# Altium project NB3000XN.PRJPCB (part 3 of 3)

## Sheet Ethernet_RTL8201CL.SchDoc: Ethernet Interface
size A3; DocumentNumber: 21; SheetNumber: 22; SheetTotal: 78; Organization: Altium Limited.; Address1: Level 3, 12a Rodborough Rd; Address2: Frenchs Forest 2086; Address3: NSW; Address4: AUSTRALIA
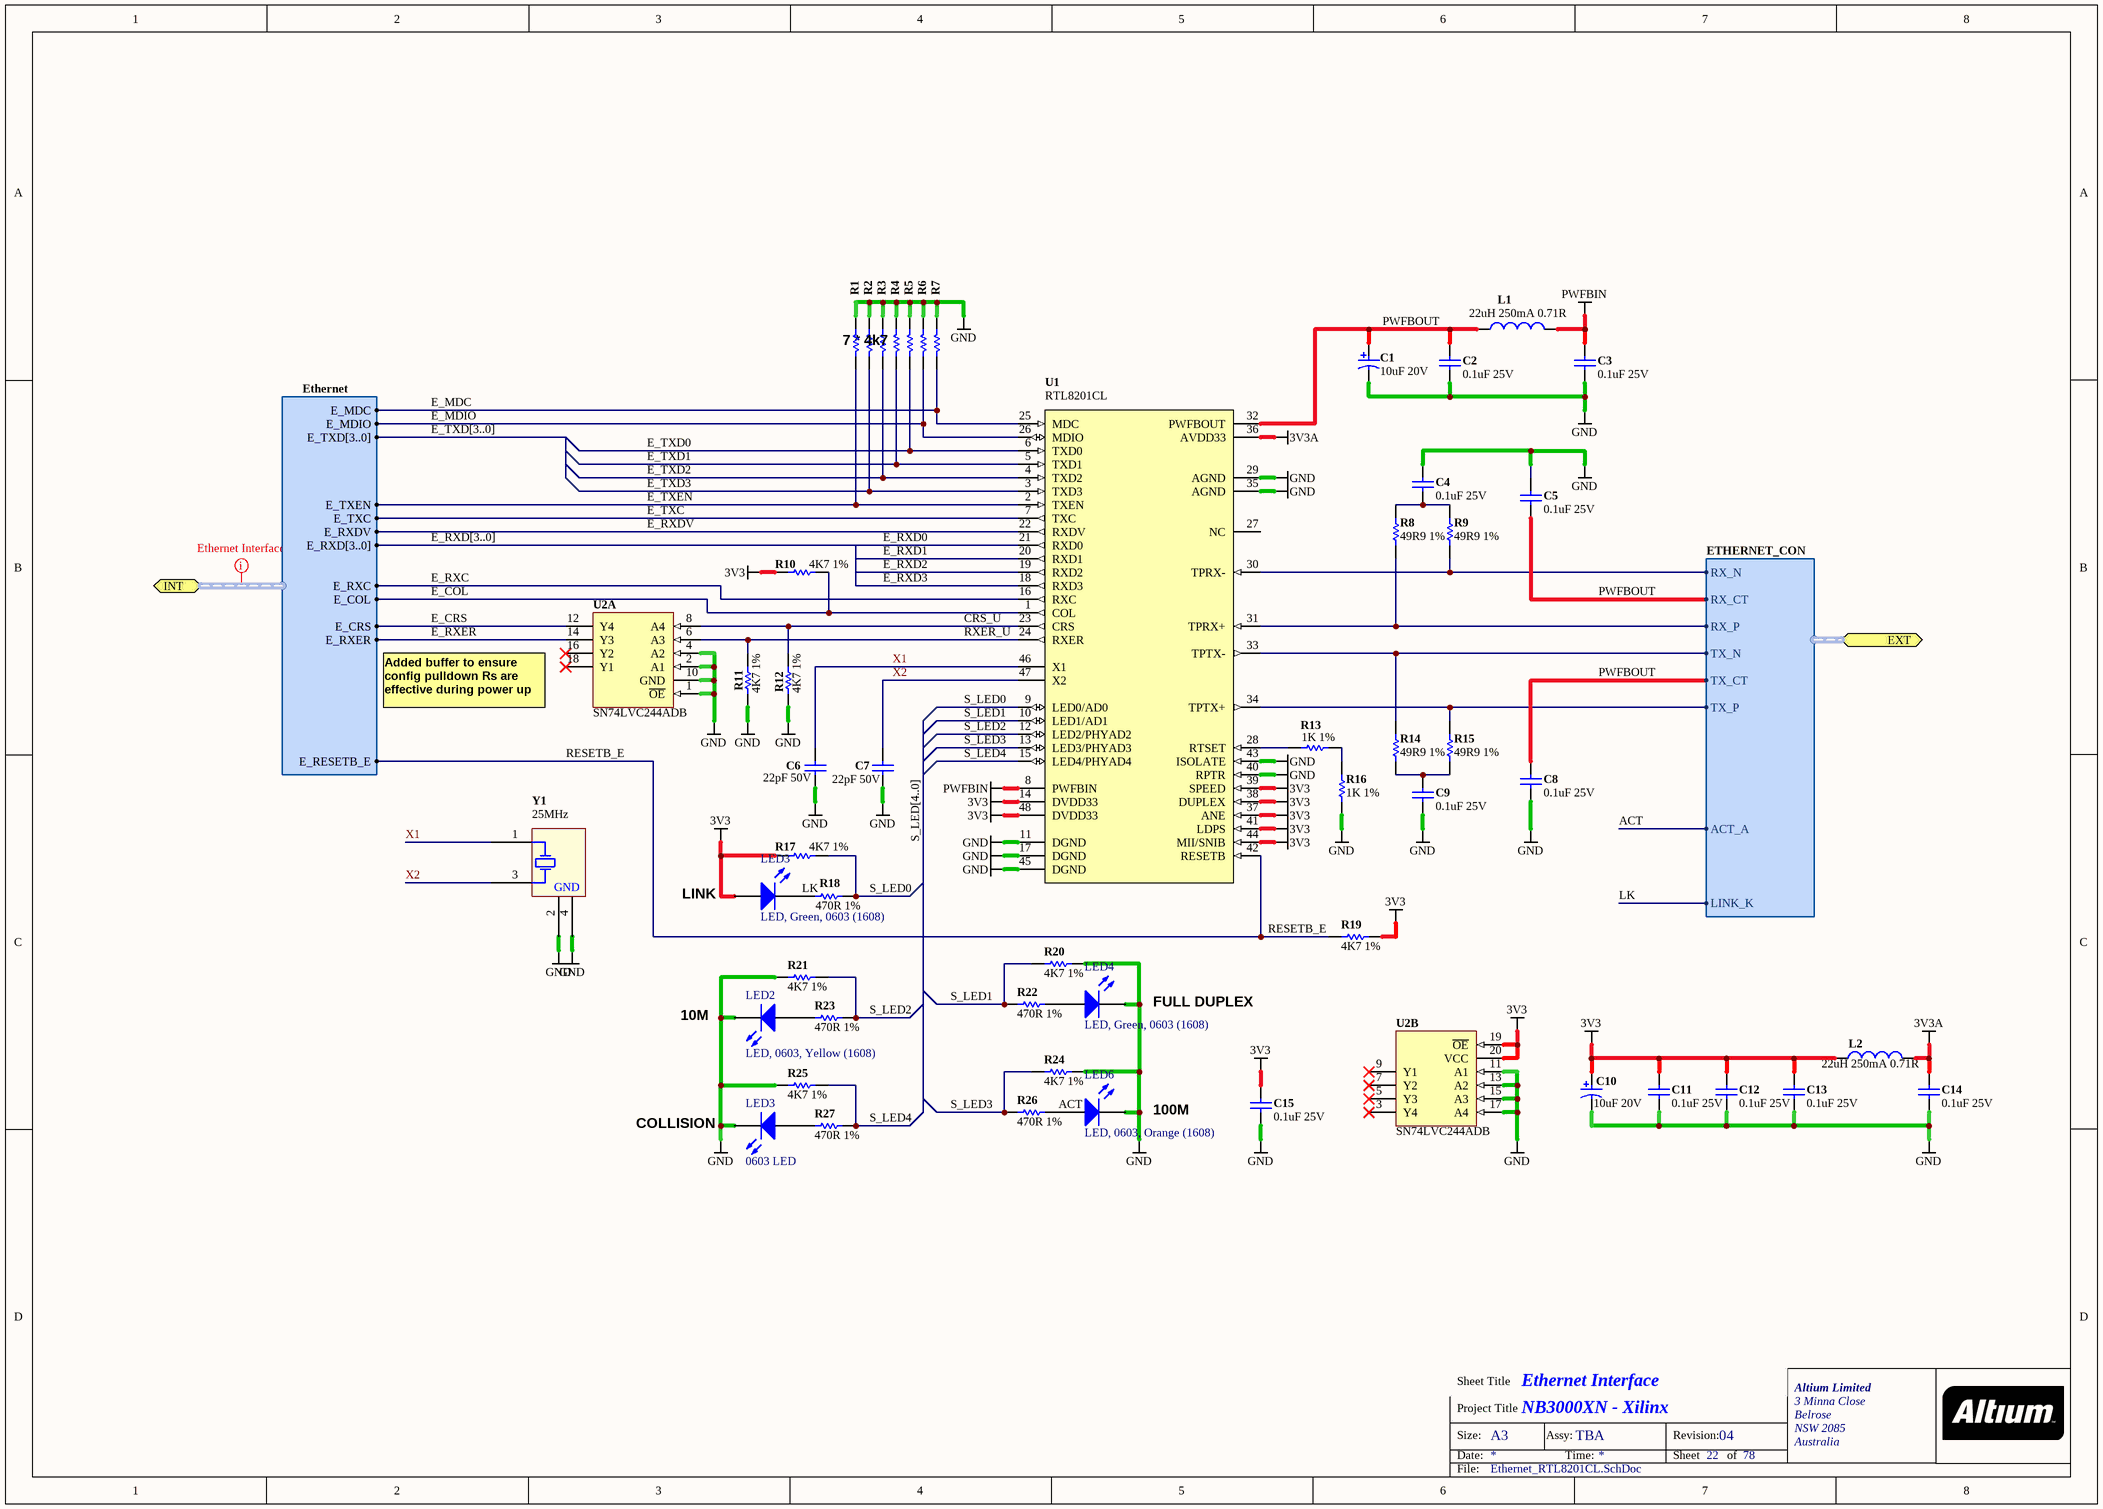
[diagram p14: Ethernet_RTL8201CL.SchDoc]

### Parts
(Parts that share a designator on the sheet are numbered #1, #2 ... from top to bottom, then left to right.)
C1#3  10uF 20V  [CAPC3528-STAR]
C2#3  0.1uF 25V  [CAPC1005-STAR]
C3#3  0.1uF 25V  [CAPC1005-STAR]
C4#3  0.1uF 25V  [CAPC1005-STAR]
C5#2  0.1uF 25V  [CAPC1005-STAR]
C6  22pF 50V  [CAPC1005-STAR]
C7  22pF 50V  [CAPC1005-STAR]
C8  0.1uF 25V  [CAPC1005-STAR]
C9  0.1uF 25V  [CAPC1005-STAR]
C10  10uF 20V  [CAPC3528-STAR]
C11  0.1uF 25V  [CAPC1005-STAR]
C12  0.1uF 25V  [CAPC1005-STAR]
C13  0.1uF 25V  [CAPC1005-STAR]
C14  0.1uF 25V  [CAPC1005-STAR]
C15  0.1uF 25V  [CAPC1005-STAR]
L1#2  22uH 250mA 0.71R  [INDC3225]
L2  22uH 250mA 0.71R  [INDC3225]
LED2  LED, 0603, Yellow (1608)  [0603LED_YELLOW]
LED3#1  LED, Green, 0603 (1608)  [0603LED_GREEN]
LED3#2  0603 LED  [0603LED_RED]
LED4  LED, Green, 0603 (1608)  [0603LED_GREEN]
LED6  LED, 0603, Orange (1608)  [0603LED_ORANGE]
R1#5  4K7 1%  [RESC1005-STAR]  (value not drawn)
R2#5  4K7 1%  [RESC1005-STAR]  (value not drawn)
R3#5  4K7 1%  [RESC1005-STAR]  (value not drawn)
R4#3  4K7 1%  [RESC1005-STAR]  (value not drawn)
R5#2  4K7 1%  [RESC1005-STAR]  (value not drawn)
R6#2  4K7 1%  [RESC1005-STAR]  (value not drawn)
R7#2  4K7 1%  [RESC1005-STAR]  (value not drawn)
R8#2  49R9 1%  [RESC2012-STAR]
R9#2  49R9 1%  [RESC2012-STAR]
R10#2  4K7 1%  [RESC1005-STAR]
R11  4K7 1%  [RESC1005-STAR]
R12#2  4K7 1%  [RESC1005-STAR]
R13  1K 1%  [RESC1005-STAR]
R14#2  49R9 1%  [RESC2012-STAR]
R15  49R9 1%  [RESC2012-STAR]
R16  1K 1%  [RESC1005-STAR]
R17  4K7 1%  [RESC1005-STAR]
R18#2  470R 1%  [RESC1005-STAR]
R19  4K7 1%  [RESC1005-STAR]
R20#2  4K7 1%  [RESC1005-STAR]
R21  4K7 1%  [RESC1005-STAR]
R22#2  470R 1%  [RESC1005-STAR]
R23#2  470R 1%  [RESC1005-STAR]
R24#2  4K7 1%  [RESC1005-STAR]
R25  4K7 1%  [RESC1005-STAR]
R26  470R 1%  [RESC1005-STAR]
R27  470R 1%  [RESC1005-STAR]
U1#5  RTL8201CL  [TSQFP50P900X900-48]
U2  SN74LVC244ADB  [SOP65P780-20]  (parts A,B of 2)
Y1#1  25MHz  [XTAL-200X126-4]

### Ports
EXT (harness ETHERNET_CON), INT (harness Ethernet)

### Harnesses
Ethernet: E_MDC, E_MDIO, E_TXD[3..0], E_TXC, E_TXEN, E_RXDV, E_RXD[3..0], E_RESETB_E, E_RXC, E_COL, E_CRS, E_RXER
ETHERNET_CON: TX_P, TX_N, RX_P, RX_N, RX_CT, TX_CT, LINK_K, ACT_A

### Nets
3V3: C10.1 C11.2 C12.2 C13.2 C15.2 L2.1 LED3#1.1(A) R10#2.2 R17.2 R19.2 U1#5.14(DVDD33) U1#5.37(ANE) U1#5.38(DUPLEX) U1#5.39(SPEED) U1#5.41(LDPS) U1#5.44(MII/SNIB) U1#5.48(DVDD33) U2.19(~{OE}) U2.20(VCC)
3V3A: C14.2 L2.2 U1#5.36(AVDD33)
GND: C1#3.2 C2#3.1 C3#3.1 C4#3.2 C5#2.2 C6.1 C7.1 C8.1 C9.1 C10.2 C11.1 C12.1 C13.1 C14.1 C15.1 LED2.2(K) LED3#2.2(K) LED4.2(K) LED6.2(K) R1#5.2 R2#5.2 R3#5.2 R4#3.2 R5#2.2 R6#2.2 R7#2.2 R11.2 R12#2.2 R16.1 R20#2.1 R21.2 R24#2.1 R25.2 U1#5.11(DGND) U1#5.17(DGND) U1#5.29(AGND) U1#5.35(AGND) U1#5.40(RPTR) U1#5.43(ISOLATE) U1#5.45(DGND) U2.1(~{OE}) U2.2(A1) U2.4(A2) U2.10(GND) U2.11(A1) U2.13(A2) U2.15(A3) U2.17(A4) Y1#1.2(GND) Y1#1.4(GND)
PWFBIN: C3#3.2 L1#2.2 U1#5.8(PWFBIN)
ACT: LED6.1(A) R26.2 ; port EXT.ACT_A  [project net ETH#.ACT_A]
CRS_U: R12#2.1 U1#5.23(CRS) U2.8(A4)
E_COL: R10#2.1 U1#5.1(COL) ; port INT.E_COL  [project net ETH.E_COL]
E_CRS: U2.12(Y4) ; port INT.E_CRS  [project net ETH.E_CRS]
E_MDC: R7#2.1 U1#5.25(MDC) ; port INT.E_MDC  [project net ETH.E_MDC]
E_MDIO: R6#2.1 U1#5.26(MDIO) ; port INT.E_MDIO  [project net ETH.E_MDIO]
E_RXC: U1#5.16(RXC) ; port INT.E_RXC  [project net ETH.E_RXC]
E_RXD0: U1#5.21(RXD0)
E_RXD1: U1#5.20(RXD1)
E_RXD2: U1#5.19(RXD2)
E_RXD3: U1#5.18(RXD3)
E_RXDV: U1#5.22(RXDV) ; port INT.E_RXDV  [project net ETH.E_RXDV]
E_RXER: U2.14(Y3) ; port INT.E_RXER  [project net ETH.E_RXER]
E_TXC: U1#5.7(TXC) ; port INT.E_TXC  [project net ETH.E_TXC]
E_TXD0: R5#2.1 U1#5.6(TXD0)
E_TXD1: R4#3.1 U1#5.5(TXD1)
E_TXD2: R3#5.1 U1#5.4(TXD2)
E_TXD3: R2#5.1 U1#5.3(TXD3)
E_TXEN: R1#5.1 U1#5.2(TXEN) ; port INT.E_TXEN  [project net ETH.E_TXEN]
ETH#.RX_N: R9#2.1 U1#5.30(TPRX-) ; port EXT.RX_N
ETH#.RX_P: R8#2.1 U1#5.31(TPRX+) ; port EXT.RX_P
ETH#.TX_N: R14#2.2 U1#5.33(TPTX-) ; port EXT.TX_N
ETH#.TX_P: R15.2 U1#5.34(TPTX+) ; port EXT.TX_P
LK: LED3#1.2(K) R18#2.2 ; port EXT.LINK_K  [project net ETH#.LINK_K]
PWFBOUT: C1#3.1 C2#3.2 C5#2.1 C8.2 L1#2.1 U1#5.32(PWFBOUT) ; port EXT.RX_CT, port EXT.TX_CT  [project net ETH#.RX_CT]
RESETB_E: R19.1 U1#5.42(RESETB) ; port INT.E_RESETB_E  [project net ETH.E_RESETB_E]
RXER_U: R11.1 U1#5.24(RXER) U2.6(A3)
S_LED0: R17.1 R18#2.1 U1#5.9(LED0/AD0)
S_LED1: R20#2.2 R22#2.1 U1#5.10(LED1/AD1)
S_LED2: R21.1 R23#2.1 U1#5.12(LED2/PHYAD2)
S_LED3: R24#2.2 R26.1 U1#5.13(LED3/PHYAD3)
S_LED4: R25.1 R27.1 U1#5.15(LED4/PHYAD4)
X1: C6.2 U1#5.46(X1) Y1#1.1(X1)
X2: C7.2 U1#5.47(X2) Y1#1.3(X2)
NetC4#3_1: C4#3.1 R8#2.2 R9#2.2
NetC9_2: C9.2 R14#2.1 R15.1
NetLED2_1: LED2.1(A) R23#2.2
NetLED3#2_1: LED3#2.1(A) R27.2
NetLED4_1: LED4.1(A) R22#2.2
NetR13_1: R13.1 R16.2
NetR13_2: R13.2 U1#5.28(RTSET)

Not connected (* = marked no-connect by the designer): U1#5 27(NC); U2 3(Y4)* 5(Y3)* 7(Y2)* 9(Y1)* 16(Y2)* 18(Y1)*

### Buses and harness runs
bus E_RXD[3..0]
bus E_TXD[3..0]
bus S_LED[4..0]

### Layout directives
net class Ethernet Interface: (no net found under the mark)

### Notes on the sheet
- (near R1#5) 7 * 4k7
- (near U2) Added buffer to ensure config pulldown Rs are effective during power up
- (near U2) LINK
- (near U2) 10M
- (near U2) FULL DUPLEX
- (near U2) COLLISION
- (near U2) 100M
- Sheet Title
- Project Title
- Size:
- Date:
- A3
- Assy:
- Time:
- Revision:
- Sheet
- of
- File:

### Library data of the parts
C1#3 C10 = D-101-0007: Capacitor, Tantalum, 10uF 10% 20V MCCT-B (3528); Polarity: Polarized; Capacitance: 10 uF; Category: Capacitor; Mounting Technology: Surface Mount; Rated Voltage: 20 V; Status: Production; Technology: Tantalum; Tolerance: 10 %
C2#3 C3#3 C4#3 C5#2 C8 C9 C11-C15 = D-101-0045: Capacitor, Ceramic, 0.1uF 25V 0402 (1005); Dielectric: X7R; Polarity: Non-Polarized; Tolerance: 10 %; Capacitance: 0.1 uF; Category: Capacitor; Mounting Technology: Surface Mount; Rated Voltage: 25 V; Status: Deprecated; Technology: Ceramic
C6 C7 = D-101-0059: Capacitor, Ceramic, 22pF 5% 50V 0402 (1005) COG; Polarity: Non-Polarized; Capacitance: 22 pF; Category: Capacitor; Dielectric: COG; Mounting Technology: Surface Mount; Rated Voltage: 50 V; Status: Unreleased; Technology: Ceramic; Tolerance: 5 %
L1#2 L2 = D-102-0006: Inductor, Coil 22uH  1210 (3225) LQH32CN220K21L; Max Input Current: mA; Category: Inductor; Inductance: 22 uH; Mounting Technology: Surface Mount; Status: Production
LED2 = D-153-0007: Brightness: 120mcd; Color: Yellow/Amber; Peak Wave Length: nm; Category: LED; Mounting Technology: Surface Mount; Status: Production
LED3#1 LED4 = D-153-0002: Brightness: 50mcd; Peak Wave Length: nm; Category: LED; Color: Green; Mounting Technology: Surface Mount; Status: Production
LED3#2 = D-153-0009: LED, Red 0603 (1608) 63mCd; Peak Wave Length: 630nm; Category: LED; Brightness: 63mcd; Color: Red; Mounting Technology: Surface Mount; Status: Unreleased
LED6 = D-153-0006: Brightness: 200mcd; Peak Wave Length: nm; Category: LED; Color: Orange; Mounting Technology: Surface Mount; Status: Production
R1#5 R2#5 R3#5 R4#3 R5#2 R6#2 R7#2 R10#2 R11 R12#2 R17 R19 R20#2 R21 R24#2 R25 = D-100-0088: as R1#4 on sheet HOST_FPGA_NonIO; Category: Resistor; Mounting Technology: Surface Mount; Status: Production; Tolerance: 1 %
R8#2 R9#2 R14#2 R15 = D-100-0017: Resistor, 49R9 1% 0805 (2012); Power Rating: mW; Resistance: 49.9 R; Category: Resistor; Mounting Technology: Surface Mount; Status: Production; Tolerance: 1 %
R13 R16 = D-100-0121: Resistor, 1K 1% 0402 (1005); Power Rating: 63 mW; Category: Resistor; Mounting Technology: Surface Mount; Resistance: 1 K; Status: Production; Tolerance: 1 %
R18#2 R22#2 R23#2 R26 R27 = D-100-0093: Resistor, 470R 1% 0402 (1005); Power Rating: 63 mW; Category: Resistor; Mounting Technology: Surface Mount; Resistance: 470 R; Status: Production; Tolerance: 1 %
U1#5 = D-221-0000: RTL8201CL-VD, Single-Chip/Single-Port 10/100 Fast Ethernet Phyceiver; Comm Standard: None; Category: IC-Communication; Mounting Technology: Surface Mount; Status: Production
U2 = D-205-0000: SN74LVC244ADBR,  Octal Buffer/Driver with 3-State Outputs, 2.0V - 3.6V; Category: IC-Logic; Status: Production
Y1#1 = D-103-0030: Crystal, SMD, 25.000000MHz Stab=50ppm 18.0pF; Frequency Stability: 50ppm; Load Capacitance: 18pF; Nominal Operational Voltage: mV; Frequency Tolerance: 50ppm; Mounting Technology: Surface Mount; Nominal Fequency: 25MHz; Status: Unreleased; Category: Crystal

## Sheet TSC_XPT2046.SchDoc: TFT Touchscreen Interface
size A4; Organization: Altium Limited.; Address1: Level 3, 12a Rodborough Rd; Address2: Frenchs Forest 2086; Address3: NSW; Address4: AUSTRALIA; DocumentNumber: 31; SheetNumber: 32; SheetTotal: 78
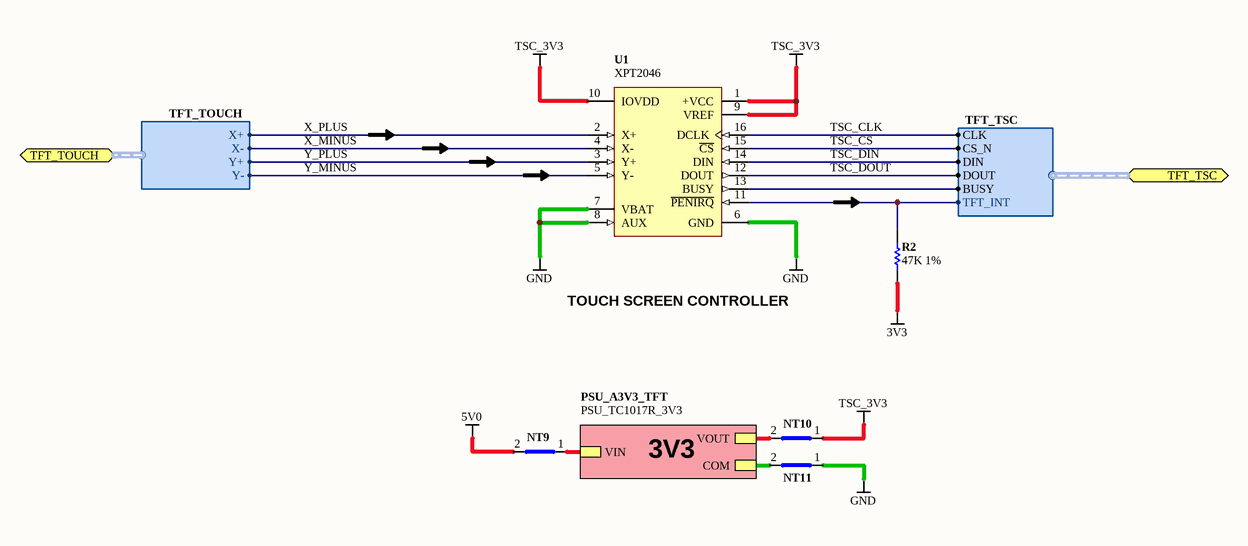
[diagram p15: TSC_XPT2046.SchDoc]

### Parts
(Parts that share a designator on the sheet are numbered #1, #2 ... from top to bottom, then left to right.)
NT9  Net Tie SMT2  [NETTIE-SMT2-31X51]  (value not drawn)  (net tie, no BOM)
NT10  Net Tie SMT2  [NETTIE-SMT2-31X51]  (value not drawn)  (net tie, no BOM)
NT11#2  Net Tie SMT2  [NETTIE-SMT2-31X51]  (value not drawn)  (net tie, no BOM)
R2#6  47K 1%  [RESC1005-STAR]
U1#6  XPT2046  [TSOP65P640-16AN]

### Sub-sheets
PSU_A3V3_TFT = PSU_TC1017R_3V3 (file not in this document): VIN, VOUT, COM

### Ports
TFT_TOUCH (harness TFT_TOUCH), TFT_TSC (harness TFT_TSC)

### Harnesses
TFT_TSC: CLK, CS_N, DIN, DOUT, BUSY, TFT_INT
TFT_TOUCH: X+, X-, Y+, Y-

### Nets
3V3: R2#6.1
5V0: NT9.2(Net2)
GND: NT11#2.1(Net1) U1#6.6(GND) U1#6.7(VBAT) U1#6.8(AUX)
TSC_3V3: NT10.1(Net1) U1#6.1(+VCC) U1#6.9(VREF) U1#6.10(IOVDD)
TFT_TSC.BUSY: U1#6.13(BUSY) ; port TFT_TSC.BUSY
TFT_TSC.TFT_INT: R2#6.2 U1#6.11(~{PENIRQ}) ; port TFT_TSC.TFT_INT
TSC_CLK: U1#6.16(DCLK) ; port TFT_TSC.CLK  [project net TFT_TSC.CLK]
TSC_CS: U1#6.15(~{CS}) ; port TFT_TSC.CS_N  [project net TFT_TSC.CS_N]
TSC_DIN: U1#6.14(DIN) ; port TFT_TSC.DIN  [project net TFT_TSC.DIN]
TSC_DOUT: U1#6.12(DOUT) ; port TFT_TSC.DOUT  [project net TFT_TSC.DOUT]
X_MINUS: U1#6.4(X-) ; port TFT_TOUCH.X-  [project net TFT_TOUCH.X-]
X_PLUS: U1#6.2(X+) ; port TFT_TOUCH.X+  [project net TFT_TOUCH.X+]
Y_MINUS: U1#6.5(Y-) ; port TFT_TOUCH.Y-  [project net TFT_TOUCH.Y-]
Y_PLUS: U1#6.3(Y+) ; port TFT_TOUCH.Y+  [project net TFT_TOUCH.Y+]
NetNT9_1: NT9.1(Net1) ; sheet PSU_A3V3_TFT/VIN
NetNT10_2: NT10.2(Net2) ; sheet PSU_A3V3_TFT/VOUT
NetNT11#2_2: NT11#2.2(Net2) ; sheet PSU_A3V3_TFT/COM

### Notes on the sheet
- TOUCH SCREEN CONTROLLER
- 3V3
- Sheet Title
- Project Title
- Size:
- Date:
- A4
- Assy:
- Time:
- Revision:
- Sheet
- of
- File:

### Library data of the parts
NT9 NT10 NT11#2 = D-002-0003: Net-Tie, Surface Mount, 2 x 1.6mm x 0.8mm SMT Pads - For 0.8mm Track; Category: Net-Tie; Status: Production
R2#6 = D-100-0092: Resistor, 47K 1% 0402 (1005); Power Rating: 63 mW; Category: Resistor; Mounting Technology: Surface Mount; Resistance: 47 K; Status: Production; Tolerance: 1 %
U1#6 = D-202-0006: XPT2046, Touch Screen Controller; Supply Voltage: 2.7 to 5.5 V; Mounting Technology: Surface Mount; Status: Unreleased; Temperature Range: -40 to +85 degC; Category: IC-Video

## Sheet LED_RGB_SMDx8.SCHDOC: Visual Indicators
size A4; DocumentNumber: 10; SheetNumber: 11; SheetTotal: 78
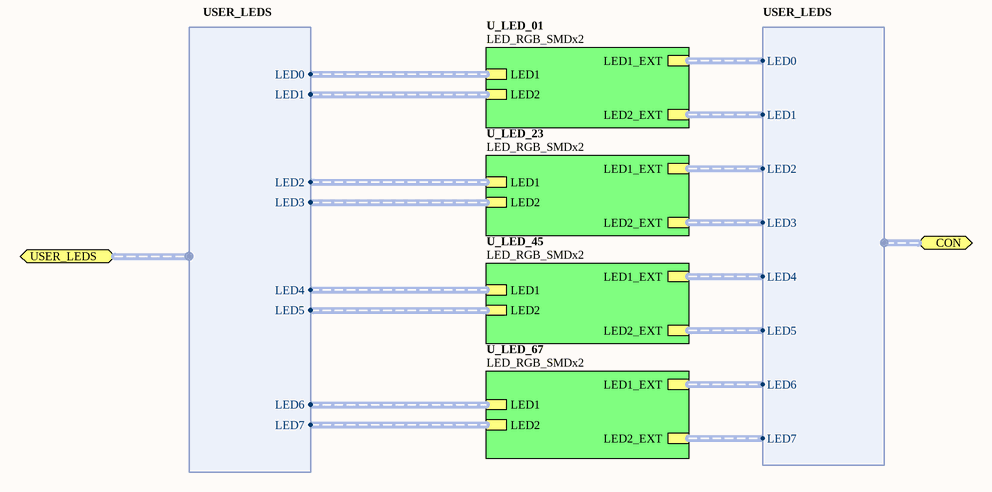
[diagram p16: LED_RGB_SMDx8.SCHDOC]

### Sub-sheets
U_LED_01 = LED_RGB_SMDx2 (file not in this document): LED1 (harness RGB_LED), LED2 (harness RGB_LED), LED1_EXT (harness RGB_LED), LED2_EXT (harness RGB_LED)
U_LED_23 = LED_RGB_SMDx2 (file not in this document): LED1 (harness RGB_LED), LED2 (harness RGB_LED), LED1_EXT (harness RGB_LED), LED2_EXT (harness RGB_LED)
U_LED_45 = LED_RGB_SMDx2 (file not in this document): LED1 (harness RGB_LED), LED2 (harness RGB_LED), LED1_EXT (harness RGB_LED), LED2_EXT (harness RGB_LED)
U_LED_67 = LED_RGB_SMDx2 (file not in this document): LED1 (harness RGB_LED), LED2 (harness RGB_LED), LED1_EXT (harness RGB_LED), LED2_EXT (harness RGB_LED)

### Ports
CON (harness USER_LEDS), USER_LEDS (harness USER_LEDS)

### Harnesses
USER_LEDS: LED0, LED1, LED2, LED3, LED4, LED5, LED6, LED7

### Notes on the sheet
- Sheet Title
- Project Title
- Size:
- Date:
- A4
- Assy:
- Time:
- Revision:
- Sheet
- of
- File:

## Sheet Audio_Codec.SchDoc: Audio CODEC
size A4; DocumentNumber: 4; SheetNumber: 6; SheetTotal: 78
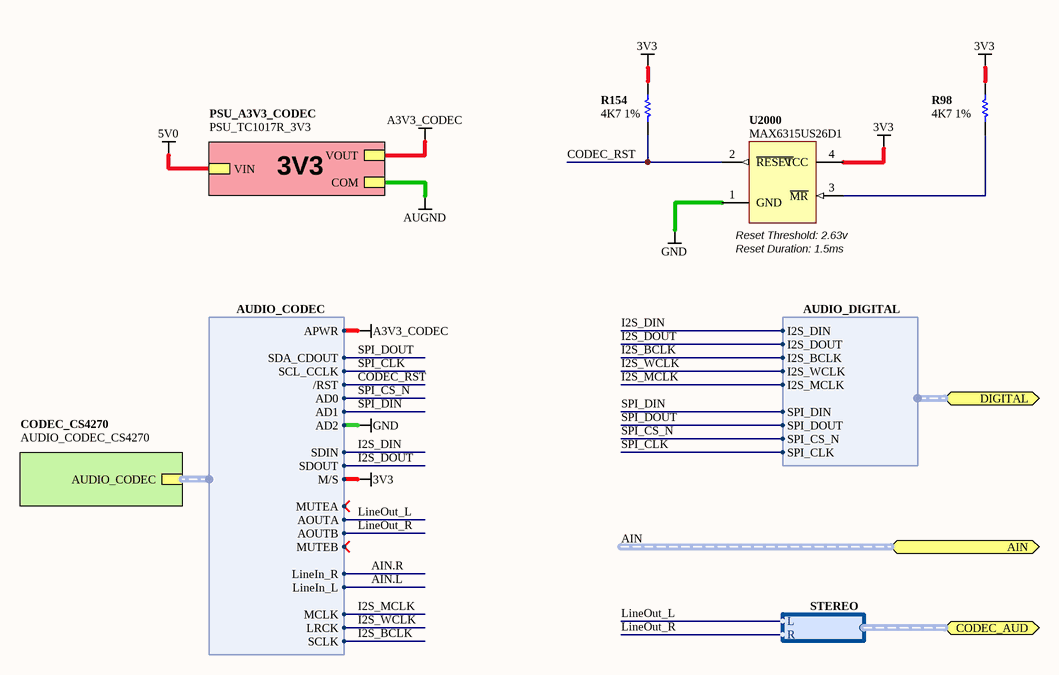
[diagram p17: Audio_Codec.SchDoc]

### Parts
(Parts that share a designator on the sheet are numbered #1, #2 ... from top to bottom, then left to right.)
R98  4K7 1%  [RESC1005-STAR]
R154#2  4K7 1%  [RESC1005-STAR]
U2000  MAX6315US26D1  [SOT143]

### Sub-sheets
CODEC_CS4270 = AUDIO_CODEC_CS4270 (file not in this document): AUDIO_CODEC (harness AUDIO_CODEC)
PSU_A3V3_CODEC = PSU_TC1017R_3V3 (file not in this document): VIN, VOUT, COM

### Ports
AIN (harness AUDIO_IN), CODEC_AUD (harness STEREO), DIGITAL (harness AUDIO_DIGITAL)

### Harnesses
AUDIO_CODEC: SDOUT, SDIN, SCLK, LRCK, MCLK, M/S, LineIn_L, LineIn_R, AOUTA, AOUTB, APWR, SCL_CCLK, AD1, SDA_CDOUT, AD0, AD2, /RST, MUTEA, MUTEB
AUDIO_DIGITAL: I2S_DOUT, I2S_DIN, I2S_BCLK, I2S_WCLK, I2S_MCLK, SPI_CLK, SPI_DIN, SPI_DOUT, SPI_CS_N
STEREO: L, R

### Nets
3V3: R98.2 R154#2.2 U2000.4(VCC) ; sheet CODEC_CS4270/AUDIO_CODEC.M/S
A3V3_CODEC: sheet PSU_A3V3_CODEC/VOUT, sheet CODEC_CS4270/AUDIO_CODEC.APWR
GND: U2000.1(GND) ; sheet CODEC_CS4270/AUDIO_CODEC.AD2
AIN.L: sheet CODEC_CS4270/AUDIO_CODEC.LineIn_L
AIN.R: sheet CODEC_CS4270/AUDIO_CODEC.LineIn_R
CODEC_RST: R154#2.1 U2000.2(~{RESET}) ; sheet CODEC_CS4270/AUDIO_CODEC./RST
I2S_BCLK: sheet CODEC_CS4270/AUDIO_CODEC.SCLK, port DIGITAL.I2S_BCLK  [project net CODEC.I2S_BCLK]
I2S_DIN: sheet CODEC_CS4270/AUDIO_CODEC.SDIN, port DIGITAL.I2S_DIN  [project net CODEC.I2S_DIN]
I2S_DOUT: sheet CODEC_CS4270/AUDIO_CODEC.SDOUT, port DIGITAL.I2S_DOUT  [project net CODEC.I2S_DOUT]
I2S_MCLK: sheet CODEC_CS4270/AUDIO_CODEC.MCLK, port DIGITAL.I2S_MCLK  [project net CODEC.I2S_MCLK]
I2S_WCLK: sheet CODEC_CS4270/AUDIO_CODEC.LRCK, port DIGITAL.I2S_WCLK  [project net CODEC.I2S_WCLK]
LineOut_L: sheet CODEC_CS4270/AUDIO_CODEC.AOUTA, port CODEC_AUD.L
LineOut_R: sheet CODEC_CS4270/AUDIO_CODEC.AOUTB, port CODEC_AUD.R
SPI_CLK: sheet CODEC_CS4270/AUDIO_CODEC.SCL_CCLK, port DIGITAL.SPI_CLK  [project net CODEC.SPI_CLK]
SPI_CS_N: sheet CODEC_CS4270/AUDIO_CODEC.AD0, port DIGITAL.SPI_CS_N  [project net CODEC.SPI_CS_N]
SPI_DIN: sheet CODEC_CS4270/AUDIO_CODEC.AD1, port DIGITAL.SPI_DIN  [project net CODEC.SPI_DIN]
SPI_DOUT: sheet CODEC_CS4270/AUDIO_CODEC.SDA_CDOUT, port DIGITAL.SPI_DOUT  [project net CODEC.SPI_DOUT]
NetR98_1: R98.1 U2000.3(~{MR})

### Buses and harness runs
harness AIN = port AIN

### Notes on the sheet
- 3V3
- (near U2000) Reset Threshold: 2.63v
- (near U2000) Reset Duration: 1.5ms
- Sheet Title
- Project Title
- Size:
- Date:
- A4
- Assy:
- Time:
- Revision:
- Sheet
- of
- File:

### Library data of the parts
R98 R154#2 = D-100-0088: Resistor, 4K7 1% 0402 (1005); Power Rating: 63 mW; Resistance: 4.7 K; Category: Resistor; Mounting Technology: Surface Mount; Status: Production; Tolerance: 1 %
U2000 = D-243-0000: MAX6315, Open-Drain Output SOT Reset IC, Customized Reset Thresholds, Timeout Delays; Category: IC-Other; Status: Production

## Sheet Mounts.SchDoc: NB3000XN Holes and Graphics
size A4; Organization: Altium Limited.; Address1: 3 Minna Close; Address2: Belrose; Address3: NSW 2085; Address4: AUSTRALIA; DocumentNumber: 19; Revision: 6; SheetNumber: 20; SheetTotal: 78
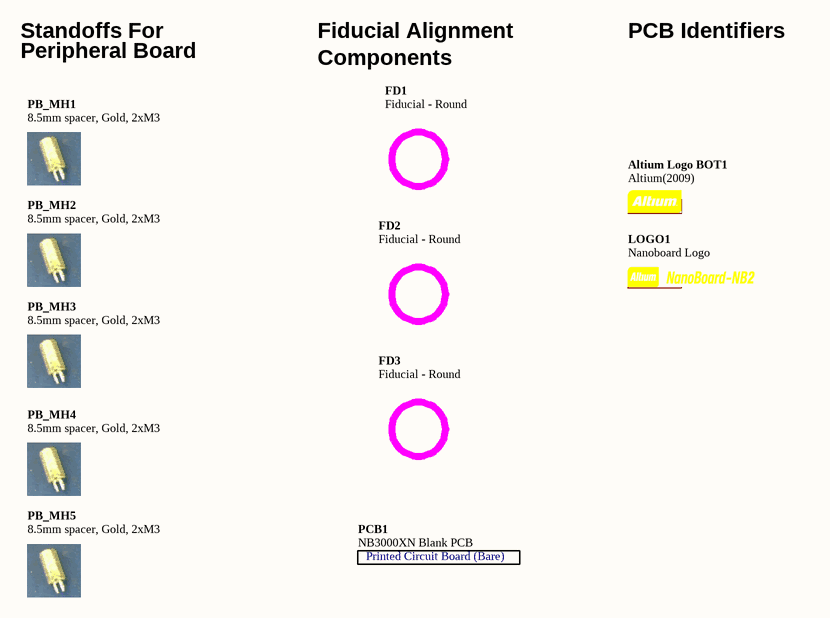
[diagram p18: Mounts.SchDoc]

### Parts
Altium_Logo_BOT1  Altium(2009)  [Logo-Altium-New]  (no BOM)
FD1  Fiducial - Round  [FIDUCIAL ROUND]  (no BOM)
FD2  Fiducial - Round  [FIDUCIAL ROUND]  (no BOM)
FD3  Fiducial - Round  [FIDUCIAL ROUND]  (no BOM)
LOGO1  Nanoboard Logo  [NANOBOARD LOGO]  (no BOM)
PB_MH1  8.5mm spacer, Gold, 2xM3  [STANDOFF_SOLDER_3MM]
PB_MH2  8.5mm spacer, Gold, 2xM3  [STANDOFF_SOLDER_3MM]
PB_MH3  8.5mm spacer, Gold, 2xM3  [STANDOFF_SOLDER_3MM]
PB_MH4  8.5mm spacer, Gold, 2xM3  [STANDOFF_SOLDER_3MM]
PB_MH5  8.5mm spacer, Gold, 2xM3  [STANDOFF_SOLDER_3MM]
PCB1  NB3000XN Blank PCB  [NB2STR01 Blank PCB]

### Nets
SHIELD: PB_MH1.STAND PB_MH2.STAND PB_MH3.STAND PB_MH4.STAND PB_MH5.STAND

### Notes on the sheet
- Peripheral Board
- Standoffs For
- Fiducial Alignment
- Components
- PCB Identifiers
- Sheet Title
- Project Title
- Size:
- Date:
- A4
- Assy:
- Time:
- Sheet
- Revision:
- of
- File:
- (in symbol D-810-0050) Printed Circuit Board (Bare)

### Library data of the parts
Altium_Logo_BOT1 = D-000-0003: Altium Logo for PCB; Category: Graphic-PCB; Status: Production
FD1-FD3 = D-004-0001: Fiducial - Round 1.5mm Top-Bottom; Status: Unreleased; Category: Fiducial
LOGO1 = D-000-0000: Status: Production; Category: Graphic-PCB
PB_MH1-PB_MH5 = D-306-0001: Spacer, 8.5mm GOLD, Splitted bottom, Female M3-thread; Category: Standoff; Status: Production
PCB1 = D-810-0050: NB3000XN Blank PCB - NanoBoard  3000 Series with Xilinx-3AN; ProjectPath: NB2STR01.PrjPCB; Status: Unreleased; Category: Blank PCB

## Sheet PWJACK+SWITCH.SchDoc: Power Jack & Switch
size A4; Organization: Altium Limited.; Address1: Level 3, 12a Rodborough Rd; Address2: Frenchs Forest 2086; Address3: NSW; Address4: AUSTRALIA; DocumentNumber: 20; Revision: 6; SheetNumber: 21; SheetTotal: 78
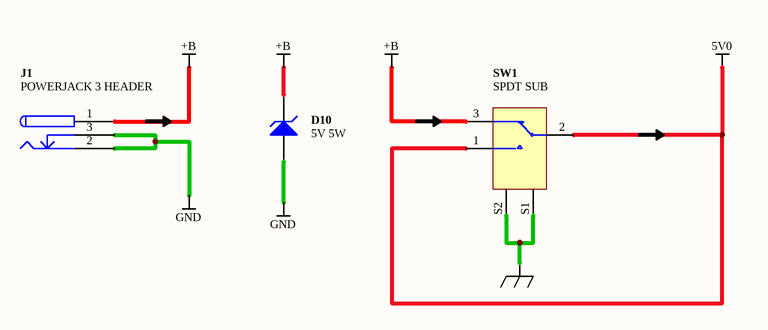
[diagram p19: PWJACK+SWITCH.SchDoc]

### Parts
(Parts that share a designator on the sheet are numbered #1, #2 ... from top to bottom, then left to right.)
D10  5V 5W  [DIOM8059]
J1#4  POWERJACK 3 HEADER  [KLD-0202]
SW1  SPDT SUB  [T8019L-TNQ]

### Nets
5V0: SW1.1 SW1.2
+B: D10.2(K) J1#4.1 SW1.3
GND: D10.1(A) J1#4.2 J1#4.3
SHIELD: SW1.S1 SW1.S2

### Notes on the sheet
- Sheet Title
- Project Title
- Size:
- Date:
- A4
- Assy:
- Time:
- Sheet
- Revision:
- of
- File:

### Library data of the parts
D10 = D-150-0001: Zener Diode, 5V 5W; Max Forward Current: mA; Rated Voltage: mV; Category: Diode-Zener; Mounting Technology: Surface Mount; Status: Production
J1#4 = D-300-0007: Connector, 3 Conductor Power Jack 2 break 2 aux contacts; ClassName: COMP_5V0; Category: Connector; Connector type: POWERJACK 3 HEADER; Status: Production
SW1 = D-301-0000: Switch, SPDT Subminiature Toggle; ClassName: COMP_5V0; Category: Switch; Status: Production

## Sheet USERPWR.SchDoc: USER HEADER POWER
size A4; Organization: Altium Limited.; Address1: Level 3, 12a Rodborough Rd; Address2: Frenchs Forest 2086; Address3: NSW; Address4: AUSTRALIA; DocumentNumber: 25; SheetNumber: 26; SheetTotal: 78
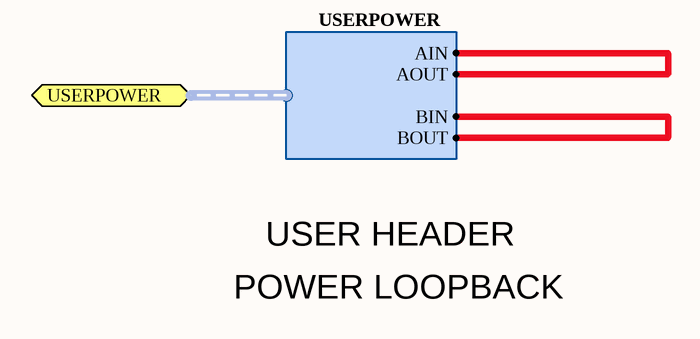
[diagram p20: USERPWR.SchDoc]

### Ports
USERPOWER (harness USERPOWER)

### Harnesses
USERPOWER: AIN, BIN, AOUT, BOUT

### Nets
UIO_PWR.AIN: port USERPOWER.AIN, port USERPOWER.AOUT
UIO_PWR.BIN: port USERPOWER.BIN, port USERPOWER.BOUT

### Notes on the sheet
- POWER LOOPBACK
- USER HEADER
- Sheet Title
- Project Title
- Size:
- Date:
- A4
- Assy:
- Time:
- Revision:
- Sheet
- of
- File:

## Sheet OSC_24MHZ.SchDoc: 24MHz Oscillator
size A4; Organization: Altium Limited.; Address1: Level 3, 12a Rodborough Rd; Address2: Frenchs Forest 2086; Address3: NSW; Address4: AUSTRALIA; DocumentNumber: 50; SheetNumber: 51; SheetTotal: 78
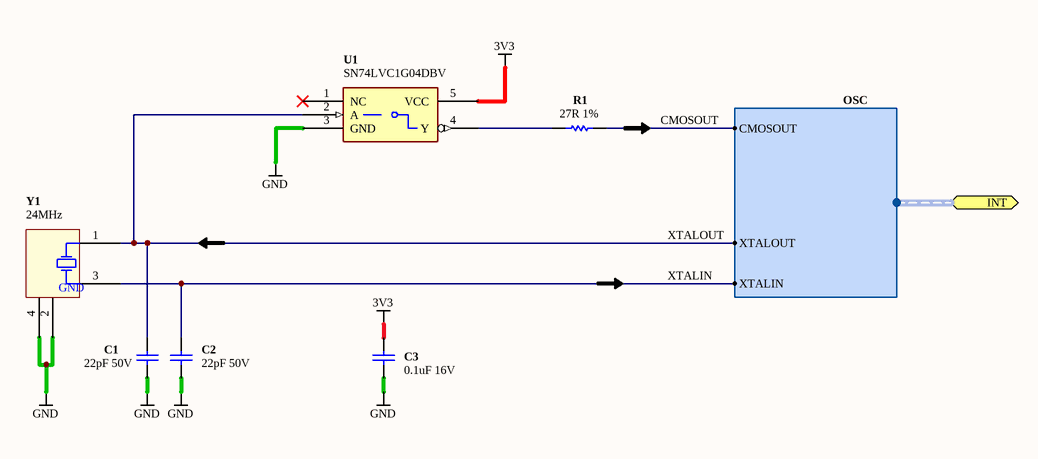
[diagram p21: OSC_24MHZ.SchDoc]

### Parts
(Parts that share a designator on the sheet are numbered #1, #2 ... from top to bottom, then left to right.)
C1#4  22pF 50V  [CAPC1005-STAR]
C2#4  22pF 50V  [CAPC1005-STAR]
C3#4  0.1uF 16V  [CAPC1005-STAR]
R1#6  27R 1%  [RESC1005-STAR]
U1#7  SN74LVC1G04DBV  [SOT95P280-5]
Y1#2  24MHz  [XTAL-200X126-4]

### Ports
INT (harness OSC)

### Harnesses
OSC: CMOSOUT, XTALIN, XTALOUT

### Nets
3V3: C3#4.1 U1#7.5(VCC)
GND: C1#4.2 C2#4.2 C3#4.2 U1#7.3(GND) Y1#2.2(GND) Y1#2.4(GND)
CMOSOUT: R1#6.1 ; port INT.CMOSOUT  [project net DBUSB.XTALIN]
XTALIN: C2#4.1 Y1#2.3(X2) ; port INT.XTALIN  [project net HOST_USB.XTALIN]
XTALOUT: C1#4.1 U1#7.2(A) Y1#2.1(X1) ; port INT.XTALOUT  [project net HOST_USB.XTALOUT]
NetR1#6_2: R1#6.2 U1#7.4(Y)

Not connected (* = marked no-connect by the designer): U1#7 1(NC)*

### Notes on the sheet
- Sheet Title
- Project Title
- Size:
- Date:
- A4
- Assy:
- Time:
- Revision:
- Sheet
- of
- File:

### Library data of the parts
C1#4 C2#4 = D-101-0059: Capacitor, Ceramic, 22pF 5% 50V 0402 (1005) COG; Polarity: Non-Polarized; Category: Capacitor; Capacitance: 22 pF; Dielectric: COG; Mounting Technology: Surface Mount; Rated Voltage: 50 V; Status: Unreleased; Technology: Ceramic; Tolerance: 5 %
C3#4 = D-101-0080: Capacitor, Ceramic, 0.1uF 10% 16V 0402 (1005) X7R; Polarity: Non-Polarized; Category: Capacitor; Capacitance: 0.1 uF; Dielectric: X7R; Mounting Technology: Surface Mount; Rated Voltage: 16 V; Status: Production; Technology: Ceramic; Tolerance: 10 %
R1#6 = D-100-0108: Resistor, 27R 1% 0402 (1005); Power Rating: 63 mW; Category: Resistor; Mounting Technology: Surface Mount; Resistance: 27 R; Status: Production; Tolerance: 1 %
U1#7 = D-205-0001: SN74LVC1G04DBV, Single Inverter Gate, 1.65-V to 5.5-V; Mounting Technology: Surface Mount; Status: Production; Category: IC-Logic
Y1#2 = D-103-0013: Crystal, SMD, 24.000000MHz Stab=30ppm 20.0pF; Frequency Stability: 30 ppm; Load Capacitance: 20 pF; Nominal Operational Voltage: mV; Category: Crystal; Frequency Tolerance: 30 ppm; Mounting Technology: Surface Mount; Nominal Fequency: 24 MHz; Status: Unreleased

## Nets that join several sheets
1V2: PSU (TP7.1), FPGA_NonIO (23 pins), FPGA_USER/USER_DECOUPLING_CAPS_1V2 (12 pins), HOST_FPGA_NonIO (9 pins), FPGA_HOST/HOST_DECOUPLING_CAPS_1V2 (12 pins)
3V3: PSU (TP4.1), FPGA (10 pins), FPGA_NonIO (50 pins), FPGA_USER/USER_DECOUPLING_CAPS_3V3 (48 pins), VIDEO_DAC_THS8134B (C1#2.1 U1#3.12 U1#3.23 U1#3.24), Host_FPGA (6 pins), HOST_FPGA_NonIO (36 pins), FPGA_HOST/HOST_DECOUPLING_CAPS_3V3 (48 pins), DBUSB_TXRX (19 pins), Ethernet_RTL8201CL (19 pins), TSC_XPT2046 (R2#6.1), Audio_Codec (R98.2 R154#2.2 U2000.4), DBUSB_TXRX (19 pins), OSC_24MHZ (C3#4.1 U1#7.5)
5V0: PSU (6 pins), VIDEO_DAC_THS8134B (L1#1.1), TSC_XPT2046 (NT9.2), PWJACK+SWITCH (SW1.1 SW1.2)
+B: PSU (TP3.1), PWJACK+SWITCH (D10.2 J1#4.1 SW1.3)
GND: PSU (16 pins), FPGA (5 pins), FPGA_NonIO (78 pins), FPGA_USER/USER_DECOUPLING_CAPS_1V2 (12 pins), FPGA_USER/USER_DECOUPLING_CAPS_3V3 (48 pins), VGA_OUT (U1#2.2), VIDEO_DAC_THS8134B (17 pins), Host_FPGA (J1#2.2 R3#3.2), HOST_FPGA_NonIO (44 pins), FPGA_HOST/HOST_DECOUPLING_CAPS_1V2 (12 pins), FPGA_HOST/HOST_DECOUPLING_CAPS_3V3 (48 pins), HOST_JTAG (J1#3.9 J1#3.10), DBUSB_TXRX (21 pins), Ethernet_RTL8201CL (50 pins), TSC_XPT2046 (NT11#2.1 U1#6.6 U1#6.7 U1#6.8), Audio_Codec (U2000.1), PWJACK+SWITCH (D10.1 J1#4.2 J1#4.3), DBUSB_TXRX (21 pins), OSC_24MHZ (6 pins)
SHIELD: PSU (C169.1 R248.1), Mounts (5 pins), PWJACK+SWITCH (SW1.S1 SW1.S2)
DB_CLOCKS.FPGA_CLK: FPGA (U1#1.AE13), Host_FPGA (U1#4.C10)
DB_CLOCKS.FPGA_CLK1: FPGA (U1#1.Y14), Host_FPGA (R1_HOST.2)
DB_CLOCKS.REF_CLK: FPGA (U1#1.K14), Host_FPGA (U1#4.A10)
DB_PROGRAM.CCLK: FPGA (R20#1.1), Host_FPGA (U1#4.V10)
DB_PROGRAM.DIN: FPGA (U1#1.AF24), Host_FPGA (U1#4.T1)
DB_PROGRAM.DONE: FPGA (R4#1.1 R22#1.1), Host_FPGA (U1#4.R2)
DB_PROGRAM.INIT: FPGA (R3#1.1 U1#1.AA15), Host_FPGA (U1#4.U3)
DB_PROGRAM.PROGRAM: FPGA (R1#1.1 R24#1.1), Host_FPGA (U1#4.R7)
DB_SPI.CLK: FPGA (U1#1.AE14), Host_FPGA (U1#4.W1)
DB_SPI.DIN: FPGA (U1#1.Y26), Host_FPGA (U1#4.N1)
DB_SPI.DOUT: FPGA (U1#1.AD21), Host_FPGA (U1#4.U1)
DB_SPI.MODE: FPGA (U1#1.AF25), Host_FPGA (U1#4.J1)
DB_SPI.SEL: FPGA (U1#1.AE23), Host_FPGA (U1#4.R3)
DBUSB.FIFOADR0: FPGA (U1#1.AA17), DBUSB_TXRX (U3A.37)
DBUSB.FIFOADR1: FPGA (U1#1.AD25), DBUSB_TXRX (U3A.38)
DBUSB.FIFOADR2: FPGA (U1#1.AA18), DBUSB_TXRX (U3A.36)
DBUSB.FLAGA: FPGA (U1#1.AC17), DBUSB_TXRX (U3A.29)
DBUSB.FLAGB: FPGA (U1#1.AB17), DBUSB_TXRX (U3A.30)
DBUSB.FLAGC: FPGA (U1#1.AA20), DBUSB_TXRX (U3A.31)
DBUSB.FLAGD_CS_N: FPGA (U1#1.AE20), DBUSB_TXRX (U3A.40)
DBUSB.IFCLK: FPGA (U1#1.V14), DBUSB_TXRX (R6A.1)
DBUSB.INT_N: FPGA (U1#1.AF22), DBUSB_TXRX (R7A.1 U3A.34)
DBUSB.PKTEND: FPGA (U1#1.AE21), DBUSB_TXRX (U3A.39)
DBUSB.RD_N: FPGA (U1#1.U16), DBUSB_TXRX (U3A.1)
DBUSB.READY: FPGA (U1#1.R24), DBUSB_TXRX (U3A.33)
DBUSB.RESET_N: FPGA (U1#1.V17), DBUSB_TXRX (U1000A.3)
DBUSB.SLOE: FPGA (U1#1.AB18), DBUSB_TXRX (U3A.35)
DBUSB.VBUS: FPGA (U1#1.AC18), DBUSB_TXRX (R2A.1 R3A.1)
DBUSB.WR_N: FPGA (U1#1.U18), DBUSB_TXRX (U3A.2)
DONE: FPGA (R22#1.2), FPGA_NonIO (U1#1.AB21)
E_RXD0: FPGA (U1#1.C1), Ethernet_RTL8201CL (U1#5.21)
E_RXD1: FPGA (U1#1.D2), Ethernet_RTL8201CL (U1#5.20)
E_RXD2: FPGA (U1#1.D1), Ethernet_RTL8201CL (U1#5.19)
E_RXD3: FPGA (U1#1.G5), Ethernet_RTL8201CL (U1#5.18)
E_TXD0: FPGA (U1#1.F4), Ethernet_RTL8201CL (R5#2.1 U1#5.6)
E_TXD1: FPGA (U1#1.E1), Ethernet_RTL8201CL (R4#3.1 U1#5.5)
E_TXD2: FPGA (U1#1.G6), Ethernet_RTL8201CL (R3#5.1 U1#5.4)
E_TXD3: FPGA (U1#1.F5), Ethernet_RTL8201CL (R2#5.1 U1#5.3)
ETH.E_COL: FPGA (U1#1.G1), Ethernet_RTL8201CL (R10#2.1 U1#5.1)
ETH.E_CRS: FPGA (U1#1.A5), Ethernet_RTL8201CL (U2.12)
ETH.E_MDC: FPGA (U1#1.B2), Ethernet_RTL8201CL (R7#2.1 U1#5.25)
ETH.E_MDIO: FPGA (U1#1.D3), Ethernet_RTL8201CL (R6#2.1 U1#5.26)
ETH.E_RESETB_E: FPGA (U1#1.E4), Ethernet_RTL8201CL (R19.1 U1#5.42)
ETH.E_RXC: FPGA (U1#1.B14), Ethernet_RTL8201CL (U1#5.16)
ETH.E_RXDV: FPGA (U1#1.C2), Ethernet_RTL8201CL (U1#5.22)
ETH.E_RXER: FPGA (U1#1.A7), Ethernet_RTL8201CL (U2.14)
ETH.E_TXC: FPGA (U1#1.H4), Ethernet_RTL8201CL (U1#5.7)
ETH.E_TXEN: FPGA (U1#1.F3), Ethernet_RTL8201CL (R1#5.1 U1#5.2)
FPGA_ID0: FPGA (NT2#2.1), Host_FPGA (U1#4.E20)
FPGA_ID1: FPGA (NT3#3.1), Host_FPGA (U1#4.R4)
FPGA_ID2: FPGA (NT4.1), Host_FPGA (U1#4.F20)
FPGA_ID3: FPGA (NT5.1), Host_FPGA (U1#4.R1)
FPGA_M0: FPGA (R23#1.1), Host_FPGA (U1#4.R5)
FPGA_M1: FPGA (R18#1.1), Host_FPGA (U1#4.V2)
FPGA_M2: FPGA (R14#1.1), Host_FPGA (U1#4.U5)
FPGA_TCK: FPGA (R9#1.1), Host_FPGA (U1#4.E10)
FPGA_TDI: FPGA (R12#1.1), Host_FPGA (U1#4.T6)
FPGA_TDO: FPGA (R2#1.1 R10#1.1), Host_FPGA (U1#4.W2)
FPGA_TMS: FPGA (R8#1.1), Host_FPGA (U1#4.V1)
HOST_HARD_TCK: HOST_FPGA_NonIO (R156.1), HOST_JTAG (J1#3.3)
HOST_HARD_TDI: HOST_FPGA_NonIO (R154#1.1), HOST_JTAG (J1#3.1)
HOST_HARD_TDO: HOST_FPGA_NonIO (R155.1), HOST_JTAG (J1#3.2)
HOST_HARD_TMS: HOST_FPGA_NonIO (R157.1), HOST_JTAG (J1#3.4)
HOST_SOFT_TCK: Host_FPGA (U1#4.D10), HOST_JTAG (J1#3.7)
HOST_SOFT_TDI: Host_FPGA (U1#4.F3), HOST_JTAG (J1#3.5)
HOST_SOFT_TDO: Host_FPGA (U1#4.F2), HOST_JTAG (J1#3.6)
HOST_SOFT_TMS: Host_FPGA (U1#4.F7), HOST_JTAG (J1#3.8)
HOST_USB.FIFOADR0: Host_FPGA (U1#4.L1), DBUSB_TXRX (U3B.37)
HOST_USB.FIFOADR1: Host_FPGA (U1#4.L3), DBUSB_TXRX (U3B.38)
HOST_USB.FIFOADR2: Host_FPGA (U1#4.K3), DBUSB_TXRX (U3B.36)
HOST_USB.FLAGA: Host_FPGA (U1#4.G1), DBUSB_TXRX (U3B.29)
HOST_USB.FLAGB: Host_FPGA (U1#4.J3), DBUSB_TXRX (U3B.30)
HOST_USB.FLAGC: Host_FPGA (U1#4.J4), DBUSB_TXRX (U3B.31)
HOST_USB.FLAGD_CS_N: Host_FPGA (U1#4.M1), DBUSB_TXRX (U3B.40)
HOST_USB.IFCLK: Host_FPGA (U1#4.H2), DBUSB_TXRX (R6B.1)
HOST_USB.INT_N: Host_FPGA (U1#4.J6), DBUSB_TXRX (R7B.1 U3B.34)
HOST_USB.PKTEND: Host_FPGA (U1#4.L5), DBUSB_TXRX (U3B.39)
HOST_USB.RD_N: Host_FPGA (U1#4.N2), DBUSB_TXRX (U3B.1)
HOST_USB.READY: Host_FPGA (U1#4.J5), DBUSB_TXRX (U3B.33)
HOST_USB.RESET_N: Host_FPGA (U1#4.P4), DBUSB_TXRX (U1000B.3)
HOST_USB.SLOE: Host_FPGA (U1#4.K2), DBUSB_TXRX (U3B.35)
HOST_USB.VBUS: Host_FPGA (U1#4.F1), DBUSB_TXRX (R2B.1 R3B.1)
HOST_USB.WR_N: Host_FPGA (U1#4.K4), DBUSB_TXRX (U3B.2)
HUSB_D0: FPGA (U1#1.AE17), DBUSB_TXRX (U3A.18)
HUSB_D0: Host_FPGA (U1#4.H4), DBUSB_TXRX (U3B.18)
HUSB_D1: FPGA (U1#1.U15), DBUSB_TXRX (U3A.19)
HUSB_D1: Host_FPGA (U1#4.F6), DBUSB_TXRX (U3B.19)
HUSB_D2: FPGA (U1#1.AD17), DBUSB_TXRX (U3A.20)
HUSB_D2: Host_FPGA (U1#4.H6), DBUSB_TXRX (U3B.20)
HUSB_D3: FPGA (U1#1.Y15), DBUSB_TXRX (U3A.21)
HUSB_D3: Host_FPGA (U1#4.G3), DBUSB_TXRX (U3B.21)
HUSB_D4: FPGA (U1#1.AC24), DBUSB_TXRX (U3A.22)
HUSB_D4: Host_FPGA (U1#4.G5), DBUSB_TXRX (U3B.22)
HUSB_D5: FPGA (U1#1.AF19), DBUSB_TXRX (U3A.23)
HUSB_D5: Host_FPGA (U1#4.G4), DBUSB_TXRX (U3B.23)
HUSB_D6: FPGA (U1#1.AE19), DBUSB_TXRX (U3A.24)
HUSB_D6: Host_FPGA (U1#4.J2), DBUSB_TXRX (U3B.24)
HUSB_D7: FPGA (U1#1.AF20), DBUSB_TXRX (U3A.25)
HUSB_D7: Host_FPGA (U1#4.H3), DBUSB_TXRX (U3B.25)
HUSB_D8: Host_FPGA (U1#4.P3), DBUSB_TXRX (U3B.45)
HUSB_D9: Host_FPGA (U1#4.M5), DBUSB_TXRX (U3B.46)
HUSB_D10: Host_FPGA (U1#4.P1), DBUSB_TXRX (U3B.47)
HUSB_D11: Host_FPGA (U1#4.M4), DBUSB_TXRX (U3B.48)
HUSB_D12: Host_FPGA (U1#4.N4), DBUSB_TXRX (U3B.49)
HUSB_D13: Host_FPGA (U1#4.M3), DBUSB_TXRX (U3B.50)
HUSB_D14: Host_FPGA (U1#4.N3), DBUSB_TXRX (U3B.51)
HUSB_D15: Host_FPGA (U1#4.M2), DBUSB_TXRX (U3B.52)
NEXUS_TCK: FPGA (U1#1.AF14), Host_FPGA (U1#4.W9)
NEXUS_TDI: FPGA (U1#1.AA19), Host_FPGA (U1#4.T4)
NEXUS_TDO: FPGA (U1#1.AC20), Host_FPGA (U1#4.T3)
NEXUS_TMS: FPGA (U1#1.AB20), Host_FPGA (U1#4.T2)
PROG_B: FPGA (R24#1.2), FPGA_NonIO (U1#1.A2)
TCK: FPGA (R9#1.2), FPGA_NonIO (U1#1.A25)
TDI: FPGA (R12#1.2), FPGA_NonIO (U1#1.G7)
TDO: FPGA (R10#1.2), FPGA_NonIO (U1#1.E23)
TFT_TSC.BUSY: FPGA (U1#1.W26), TSC_XPT2046 (U1#6.13)
TFT_TSC.CLK: FPGA (U1#1.Y13), TSC_XPT2046 (U1#6.16)
TFT_TSC.CS_N: FPGA (U1#1.AB26), TSC_XPT2046 (U1#6.15)
TFT_TSC.DIN: FPGA (U1#1.AD26), TSC_XPT2046 (U1#6.14)
TFT_TSC.DOUT: FPGA (U1#1.W25), TSC_XPT2046 (U1#6.12)
TFT_TSC.TFT_INT: FPGA (U1#1.AE25), TSC_XPT2046 (R2#6.2 U1#6.11)
TMS: FPGA (R8#1.2), FPGA_NonIO (U1#1.D4)
VGA#.BLUE: VGA_OUT (U1#2.3), VIDEO_DAC_THS8134B (R2#2.1 R3#2.2 U1#3.45)
VGA#.GREEN: VGA_OUT (U1#2.4), VIDEO_DAC_THS8134B (R4#2.1 R5#1.2 U1#3.41)
VGA#.HSYNC: FPGA (U1#1.C11), VGA_OUT (U1#2.6)
VGA#.RED: VGA_OUT (U1#2.1), VIDEO_DAC_THS8134B (R6#1.2 R7#1.2 U1#3.43)
VGA#.VSYNC: FPGA (U1#1.H12), VGA_OUT (U1#2.5)
VGA.VGA_CLK: FPGA (U1#1.C5), VIDEO_DAC_THS8134B (U1#3.26)
VGA_BLUE0: FPGA (U1#1.K12), VIDEO_DAC_THS8134B (U1#3.8)
VGA_BLUE1: FPGA (U1#1.D11), VIDEO_DAC_THS8134B (U1#3.7)
VGA_BLUE2: FPGA (U1#1.J11), VIDEO_DAC_THS8134B (U1#3.6)
VGA_BLUE3: FPGA (U1#1.A10), VIDEO_DAC_THS8134B (U1#3.5)
VGA_BLUE4: FPGA (U1#1.B10), VIDEO_DAC_THS8134B (U1#3.4)
VGA_BLUE5: FPGA (U1#1.D10), VIDEO_DAC_THS8134B (U1#3.3)
VGA_BLUE6: FPGA (U1#1.G10), VIDEO_DAC_THS8134B (U1#3.2)
VGA_BLUE7: FPGA (U1#1.E10), VIDEO_DAC_THS8134B (U1#3.1)
VGA_GREEN0: FPGA (U1#1.D8), VIDEO_DAC_THS8134B (U1#3.34)
VGA_GREEN1: FPGA (U1#1.C8), VIDEO_DAC_THS8134B (U1#3.33)
VGA_GREEN2: FPGA (U1#1.F8), VIDEO_DAC_THS8134B (U1#3.32)
VGA_GREEN3: FPGA (U1#1.B7), VIDEO_DAC_THS8134B (U1#3.31)
VGA_GREEN4: FPGA (U1#1.E7), VIDEO_DAC_THS8134B (U1#3.30)
VGA_GREEN5: FPGA (U1#1.F7), VIDEO_DAC_THS8134B (U1#3.29)
VGA_GREEN6: FPGA (U1#1.D6), VIDEO_DAC_THS8134B (U1#3.28)
VGA_GREEN7: FPGA (U1#1.G8), VIDEO_DAC_THS8134B (U1#3.27)
VGA_RED0: FPGA (U1#1.A9), VIDEO_DAC_THS8134B (U1#3.15)
VGA_RED1: FPGA (U1#1.B9), VIDEO_DAC_THS8134B (U1#3.16)
VGA_RED2: FPGA (U1#1.D9), VIDEO_DAC_THS8134B (U1#3.17)
VGA_RED3: FPGA (U1#1.G9), VIDEO_DAC_THS8134B (U1#3.18)
VGA_RED4: FPGA (U1#1.A8), VIDEO_DAC_THS8134B (U1#3.19)
VGA_RED5: FPGA (U1#1.J9), VIDEO_DAC_THS8134B (U1#3.20)
VGA_RED6: FPGA (U1#1.H9), VIDEO_DAC_THS8134B (U1#3.21)
VGA_RED7: FPGA (U1#1.B8), VIDEO_DAC_THS8134B (U1#3.22)

## Assembly variants
Production: not fitted RN1 RN2 RN3 RN4 RN5 RN6 RN7 RN8 RN17 RN18 RN19 RN20 RN21 RN22 RN23 RN24 RN25 RN26 RN27 RN28 RN29 RN30 RN31 RN32